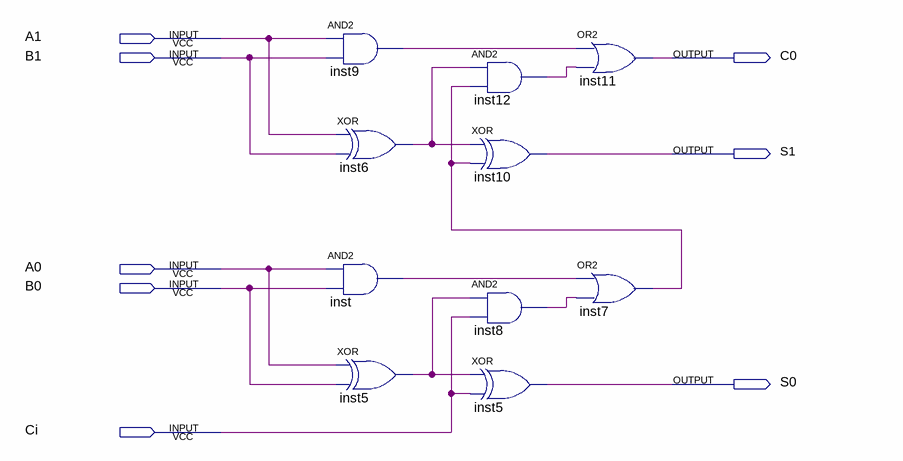
[diagram p0: schematic sheet]
// Quartus schematic Homework1_2BitAdder.bdf as structural Verilog: 10 symbols, 8 pins
module Homework1_2BitAdder (
  input  A1,
  input  B1,
  input  A0,
  input  B0,
  input  Ci,
  output C0,
  output S1,
  output S0
);

  wire inst5_out, inst6_out, inst7_out, inst8_out, inst9_out, inst12_out, inst_out;

  and inst9 (inst9_out, A1, B1);
  xor inst6 (inst6_out, A1, B1);
  and inst (inst_out, A0, B0);
  xor inst5 (inst5_out, A0, B0);
  and inst12 (inst12_out, inst6_out, inst7_out);
  xor inst10 (S1, inst6_out, inst7_out);
  and inst8 (inst8_out, inst5_out, Ci);
  xor inst5_dup2 (S0, inst5_out, Ci);
  or inst11 (C0, inst9_out, inst12_out);
  or inst7 (inst7_out, inst_out, inst8_out);
endmodule
